# Altium schematic sheet Arm Power Distro Board (A).SchDoc
size C
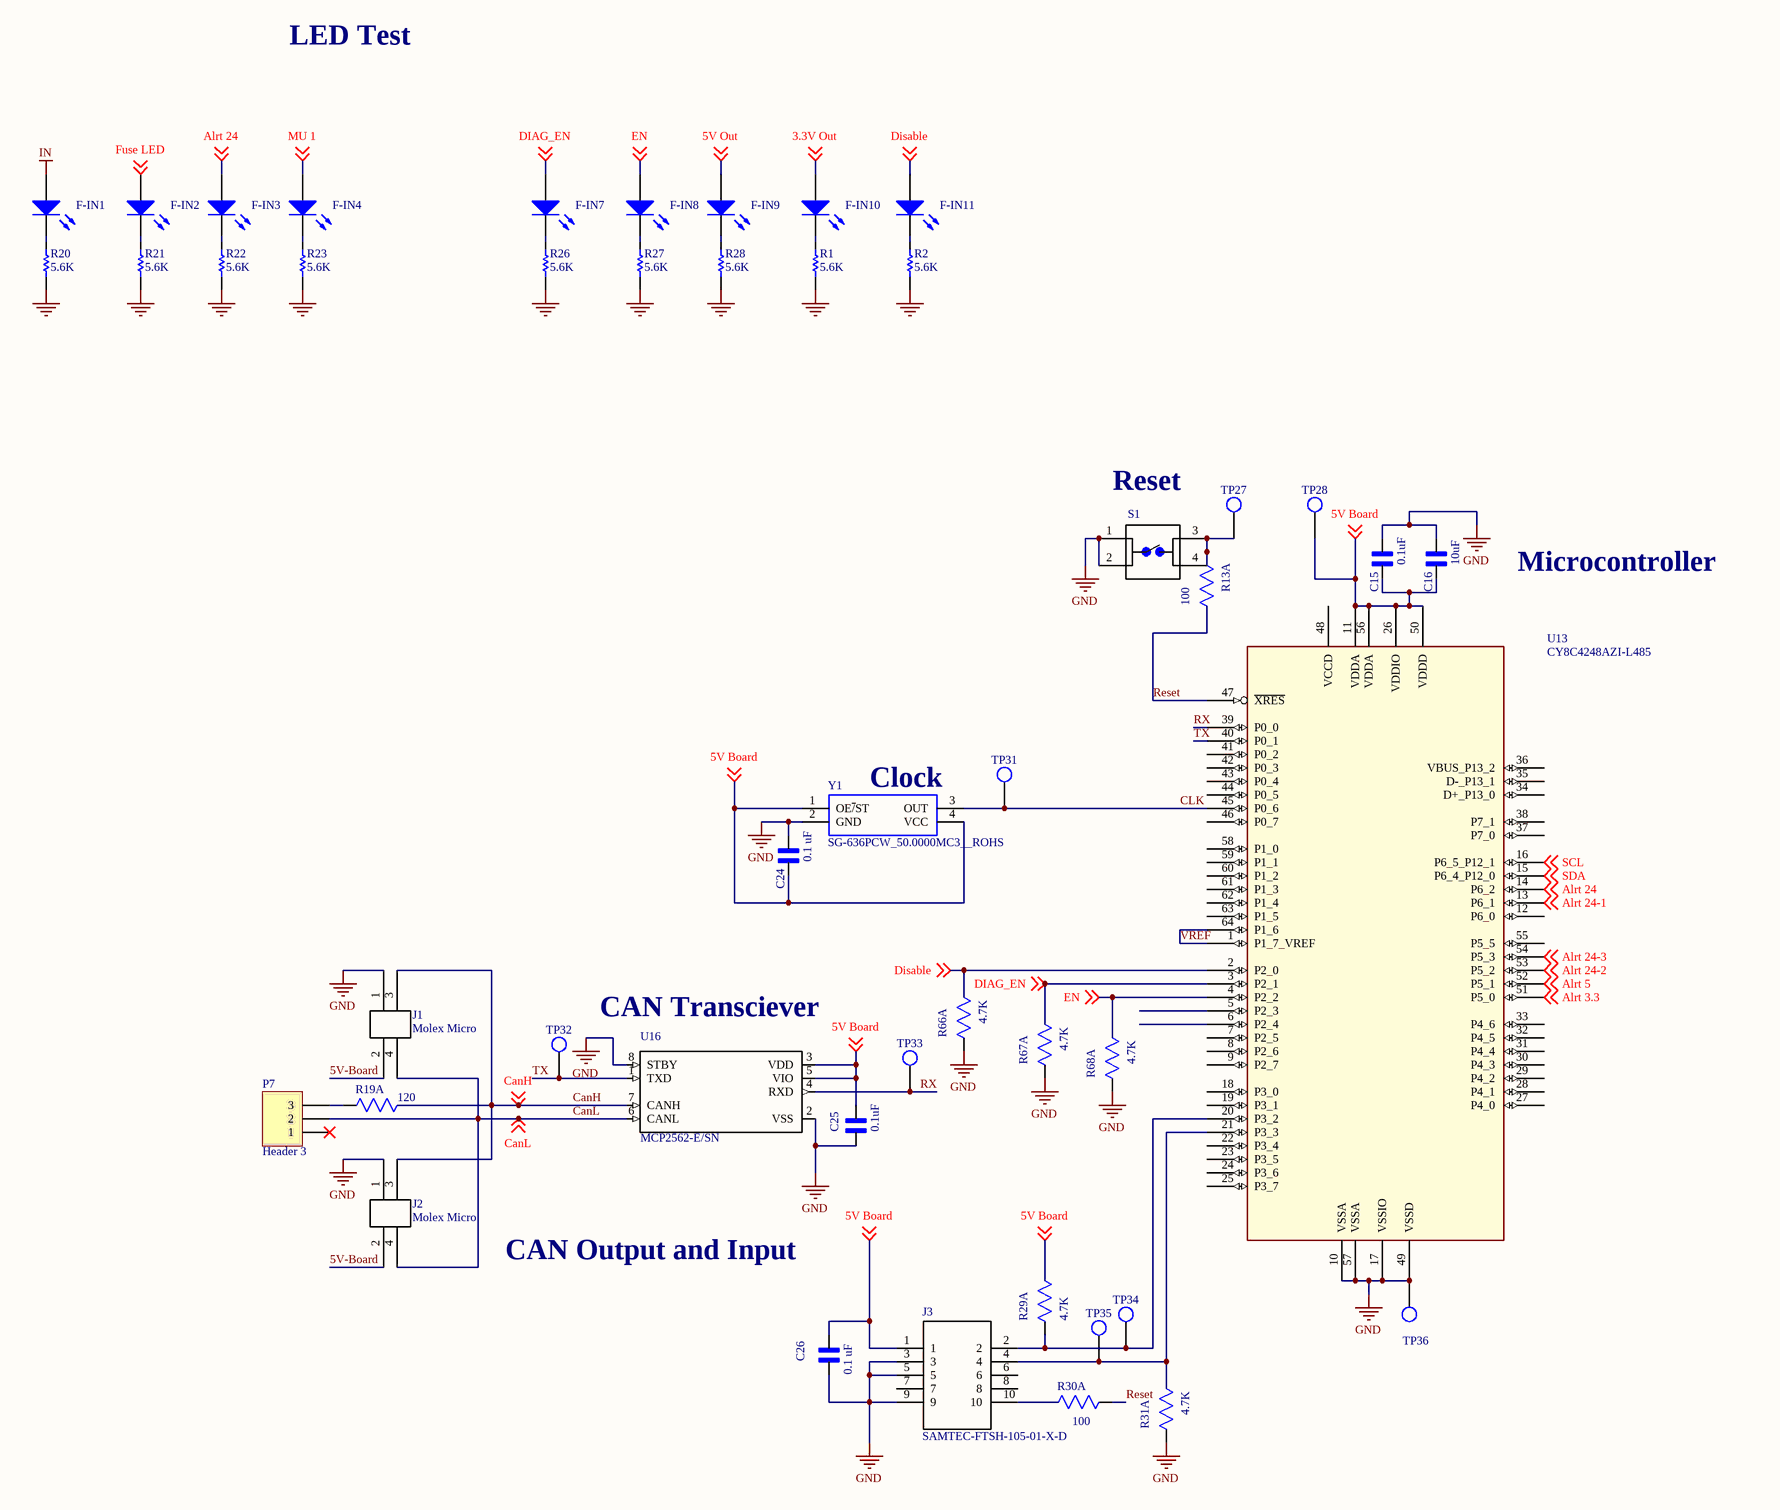
[diagram p0: Arm Power Distro Board (A).SchDoc]

## Parts
C15  0.1uF  [*CAPC2012X135N]
C16  10uF  [*CAPC2012X135N]
C24  0.1 uF  [*CAPC2012X135N]
C25  0.1uF  [*CAPC2012X135N]
C26  0.1 uF  [*CAPC2012X135N]
F-IN1  150060VS75000  [0603_A]  (value not drawn)
F-IN2  150060VS75000  [0603_A]  (value not drawn)
F-IN3  150060VS75000  [0603_A]  (value not drawn)
F-IN4  150060VS75000  [0603_A]  (value not drawn)
F-IN7  150060VS75000  [0603_A]  (value not drawn)
F-IN8  150060VS75000  [0603_A]  (value not drawn)
F-IN9  150060VS75000  [0603_A]  (value not drawn)
F-IN10  150060VS75000  [0603_A]  (value not drawn)
F-IN11  150060VS75000  [0603_A]  (value not drawn)
J1  Molex Micro  [0430450427]
J2  Molex Micro  [0430450427]
J3  SAMTEC-FTSH-105-01-X-D  [SAMTEC-FTSH-105-01-X-D]
P7  Header 3  [HDR1X3]
R1  5.6K  [RESC2013X60X35ML10T20]
R2  5.6K  [RESC2013X60X35ML10T20]
R13  100  [RC0805N]  (part A of 2)
R19  120  [RC0805N]  (part A of 2)
R20  5.6K  [RESC2013X60X35ML10T20]
R21  5.6K  [RESC2013X60X35ML10T20]
R22  5.6K  [RESC2013X60X35ML10T20]
R23  5.6K  [RESC2013X60X35ML10T20]
R26  5.6K  [RESC2013X60X35ML10T20]
R27  5.6K  [RESC2013X60X35ML10T20]
R28  5.6K  [RESC2013X60X35ML10T20]
R29  4.7K  [RC0805N]  (part A of 2)
R30  100  [RC0805N]  (part A of 2)
R31  4.7K  [RC0805N]  (part A of 2)
R66  4.7K  [RC0805N]  (part A of 2)
R67  4.7K  [RC0805N]  (part A of 2)
R68  4.7K  [RC0805N]  (part A of 2)
S1  1825910-7  [Switch 6mm 24V (NO)]  (value not drawn)
TP27  Test Point  [Test Point Through-hole]  (value not drawn)
TP28  Test Point  [Test Point Through-hole]  (value not drawn)
TP31  Test Point  [Test Point Through-hole]  (value not drawn)
TP32  Test Point  [Test Point Through-hole]  (value not drawn)
TP33  Test Point  [Test Point Through-hole]  (value not drawn)
TP34  Test Point  [Test Point Through-hole]  (value not drawn)
TP35  Test Point  [Test Point Through-hole]  (value not drawn)
TP36  Test Point  [Test Point Through-hole]  (value not drawn)
U13  CY8C4248AZI-L485  [TQFP50P1200X1200X160-64N]
U16  MCP2562-E/SN  [SOIC127P600X175-8N]
Y1  SG-636PCW_50.0000MC3__ROHS  [SG-636]

## Nets
GND: C15.2 C16.2 C24.2 C25.1 C26.1 J1.1 J2.1 J3.3 J3.5 J3.9 R1.1 R2.1 R20.1 R21.1 R22.1 R23.1 R26.1 R27.1 R28.1 R31.1 R66.1 R67.1 R68.1 S1.1 S1.2 TP36.1 U13.10(VSSA) U13.17(VSSIO) U13.49(VSSD) U13.57(VSSA) U16.2(VSS) U16.8(STBY) Y1.2(GND)
IN: F-IN1.2(A)
3.3V Out: F-IN10.2(A) ; off-sheet 3.3V Out
5V Board: C15.1 C16.1 C24.1 C25.2 C26.2 J3.1 R29.2 TP28.1 U13.11(VDDA) U13.26(VDDIO) U13.50(VDDD) U13.56(VDDA) U16.3(VDD) U16.5(VIO) Y1.1(OE~{/}ST) Y1.4(VCC) ; off-sheet 5V Board
5V Out: F-IN9.2(A) ; off-sheet 5V Out
5V-Board: J1.2 J2.2
Alrt 3.3: U13.51(P5_0) ; off-sheet Alrt 3.3
Alrt 5: U13.52(P5_1) ; off-sheet Alrt 5
Alrt 24: F-IN3.2(A) U13.14(P6_2) ; off-sheet Alrt 24
Alrt 24-1: U13.13(P6_1) ; off-sheet Alrt 24-1
Alrt 24-2: U13.53(P5_2) ; off-sheet Alrt 24-2
Alrt 24-3: U13.54(P5_3) ; off-sheet Alrt 24-3
CanH: J1.3 J2.3 R19.2 U16.7(CANH) ; off-sheet CanH
CanL: J1.4 J2.4 P7.2 U16.6(CANL) ; off-sheet CanL
CLK: TP31.1 U13.45(P0_6) Y1.3(OUT)
DIAG_EN: F-IN7.2(A) R67.2 U13.3(P2_1) ; off-sheet DIAG_EN
Disable: F-IN11.2(A) R66.2 U13.2(P2_0) ; off-sheet Disable
EN: F-IN8.2(A) R68.2 U13.4(P2_2) ; off-sheet EN
Fuse LED: F-IN2.2(A) ; off-sheet Fuse LED
MU 1: F-IN4.2(A) ; off-sheet MU 1
Reset: R13.2 R30.1 U13.47(~{XRES})
RX: TP33.1 U13.39(P0_0) U16.4(RXD)
SCL: U13.16(P6_5_P12_1) ; off-sheet SCL
SDA: U13.15(P6_4_P12_0) ; off-sheet SDA
TX: TP32.1 U13.40(P0_1) U16.1(TXD)
VREF: U13.1(P1_7_VREF) U13.64(P1_6)
NetF-IN1_1: F-IN1.1(K) R20.2
NetF-IN2_1: F-IN2.1(K) R21.2
NetF-IN3_1: F-IN3.1(K) R22.2
NetF-IN4_1: F-IN4.1(K) R23.2
NetF-IN7_1: F-IN7.1(K) R26.2
NetF-IN8_1: F-IN8.1(K) R27.2
NetF-IN9_1: F-IN9.1(K) R28.2
NetF-IN10_1: F-IN10.1(K) R1.2
NetF-IN11_1: F-IN11.1(K) R2.2
NetJ3_2: J3.2 R29.1 TP34.1 U13.20(P3_2)
NetJ3_4: J3.4 R31.2 TP35.1 U13.21(P3_3)
NetJ3_10: J3.10 R30.2
NetP7_3: P7.3 R19.1
NetR13_1: R13.1 S1.3 S1.4 TP27.1

Not connected (* = marked no-connect by the designer): J3 6 7 8; P7 1*; U13 5(P2_3) 6(P2_4) 7(P2_5) 8(P2_6) 9(P2_7) 12(P6_0) 18(P3_0) 19(P3_1) 22(P3_4) 23(P3_5) 24(P3_6) 25(P3_7) 27(P4_0) 28(P4_1) 29(P4_2) 30(P4_3) 31(P4_4) 32(P4_5) 33(P4_6) 34(D+_P13_0) 35(D-_P13_1) 36(VBUS_P13_2) 37(P7_0) 38(P7_1) 41(P0_2) 42(P0_3) 43(P0_4) 44(P0_5) 46(P0_7) 48(VCCD) 55(P5_5) 58(P1_0) 59(P1_1) 60(P1_2) 61(P1_3) 62(P1_4) 63(P1_5)

## Notes on the sheet
- LED Test
- Reset
- Microcontroller
- (near Y1) Clock
- CAN Transciever
- CAN Output and Input

## Library data of the parts
C15 C16 C24-C26 = EMK212BJ225KG-T: / Cap Ceramic 2.2uF 16V X5R 10% SMD 0805 125Â°C Embossed T/R /; MF: Taiyo Yuden; MP: EMK212BJ225KG-T; Package: 2012 Taiyo Yuden; Digi-Key_Purchase_URL: https://www.digikey.com/product-detail/en/taiyo-yuden/EMK212BJ225KG-T/587-1293-1-ND/931070?utm_source=snapeda&utm_medium=aggregator&utm_campaign=symbol; Digi-Key_Part_Number: 587-1293-1-ND; SnapEDA_Link: https://www.snapeda.com/parts/EMK212BJ225KG-T/Taiyo%20Yuden/view-part/?ref=snap; Value: *
F-IN1-F-IN4 F-IN7-F-IN11 = CMP-1426-00006-1: SMD mono-color Chip LED, WL-SMCW, Bright Green; Manufacturer: Wuerth Elektronik; ComponentLink2URL: http://katalog.we-online.com/led/datasheet/150060VS75000.pdf; ComponentLink1Description: Manufacturer URL; PackageReference: 0603_A; PartNumber: 150060VS75000; ComponentLink2Description: Datasheet; ComponentLink1URL: http://www.we-online.com; Color: Bright Green
J1 J2 = Molex micro-fit 4-pin (dual row schematic): Molex micro-fit 3.0, P/N 0430450427
P7 = Header 3: Header, 3-Pin; LatestRevisionDate: 17-Jul-2002; LatestRevisionNote: Re-released for DXP Platform.; Publisher: Altium Limited
R1 R2 R20-R23 R26-R28 = CMP-2001-01101-2: RES SMD 36K OHM 1% 1/8W 0805; Manufacturer: Yageo; Part Number: RC0805FR-0736KL; Datasheet: http://www.yageo.com/documents/recent/PYu-RC_Group_51_RoHS_L_04.pdf
R13 R19 R29-R31 R66-R68 = CRCW0805681RFKEA: No Description Available; Manufacturer_Part_Number: CRCW0805681RFKEA_1; Vendor: Vishay; Built_By: EMA_UL_Team; Copyright: Copyright (C) 2018 Accelerated Designs. All rights reserved; RefDes: RefDes; Type: DEV; Value: Value
S1 = Switch 6mm 24V (NO): FSM4JAH=6MM TACT SWITCH, HIGH TEMP; MF: TE Connectivity; Contact_Current_Rating: 50 mA; Configuration_Pole-Throw: Single Pole - Single Throw; Package: None; Digi-Key_Part_Number: 450-1804-ND; Digi-Key_Purchase_URL: https://www.digikey.com/product-detail/en/te-connectivity-alcoswitch-switches/1825910-7/450-1804-ND/1731414?utm_source=snapeda&utm_medium=aggregator&utm_campaign=symbol; MP: 1825910-7; SnapEDA_Link: https://www.snapeda.com/parts/1825910-7/TE%20Connectivity%20ALCOSWITCH%20Switches/view-part/?ref=snap; EU_RoHS_Compliance: Compliant; TE_purchase_URL: https://www.te.com/usa-en/product-1825910-7.html?te_bu=Cor&te_type=disp&te_campaign=seda_glo_cor-seda-global-disp-prtnr-fy19-seda-model-bom-cta_sma-317_1&elqCampaignId=32493; Value: *
U16 = MCP2562-E/SN: Microchip MCP2562-E/SN, CAN Transceiver 1MBps 1-channel IEC 61000-4-2, 8-Pin SOIC; Price: None; MF: Microchip; SnapEDA_Link: https://www.snapeda.com/parts/MCP2562-E/SN/Microchip/view-part/?ref=snap; MP: MCP2562-E/SN; Availability: Unavailable; Package: SO-8 Microchip; Value: *
Y1 = SG-636: Standard Clock Oscillators 50MHz 3.3Volt 100ppm -20C +70C; Manufacturer_Name: Epson Timing; Manufacturer_Part_Number: SG-636PCW 50.0000MC3: ROHS; RS Part Number: *; RS Price/Stock: *; Arrow Part Number: SG-636PCW 50.0000MC3: ROHS; Arrow Price/Stock: *; Datasheet Link: http://www.mouser.com/ds/2/137/G-636PCE_en-1003252.pdf
U13 = CY8C4248AZI-L485: Part_Number: CY8C4248AZI-L485